# Altium schematic sheet motorvezerlo.SchDoc: Motorvezérlő
size A4
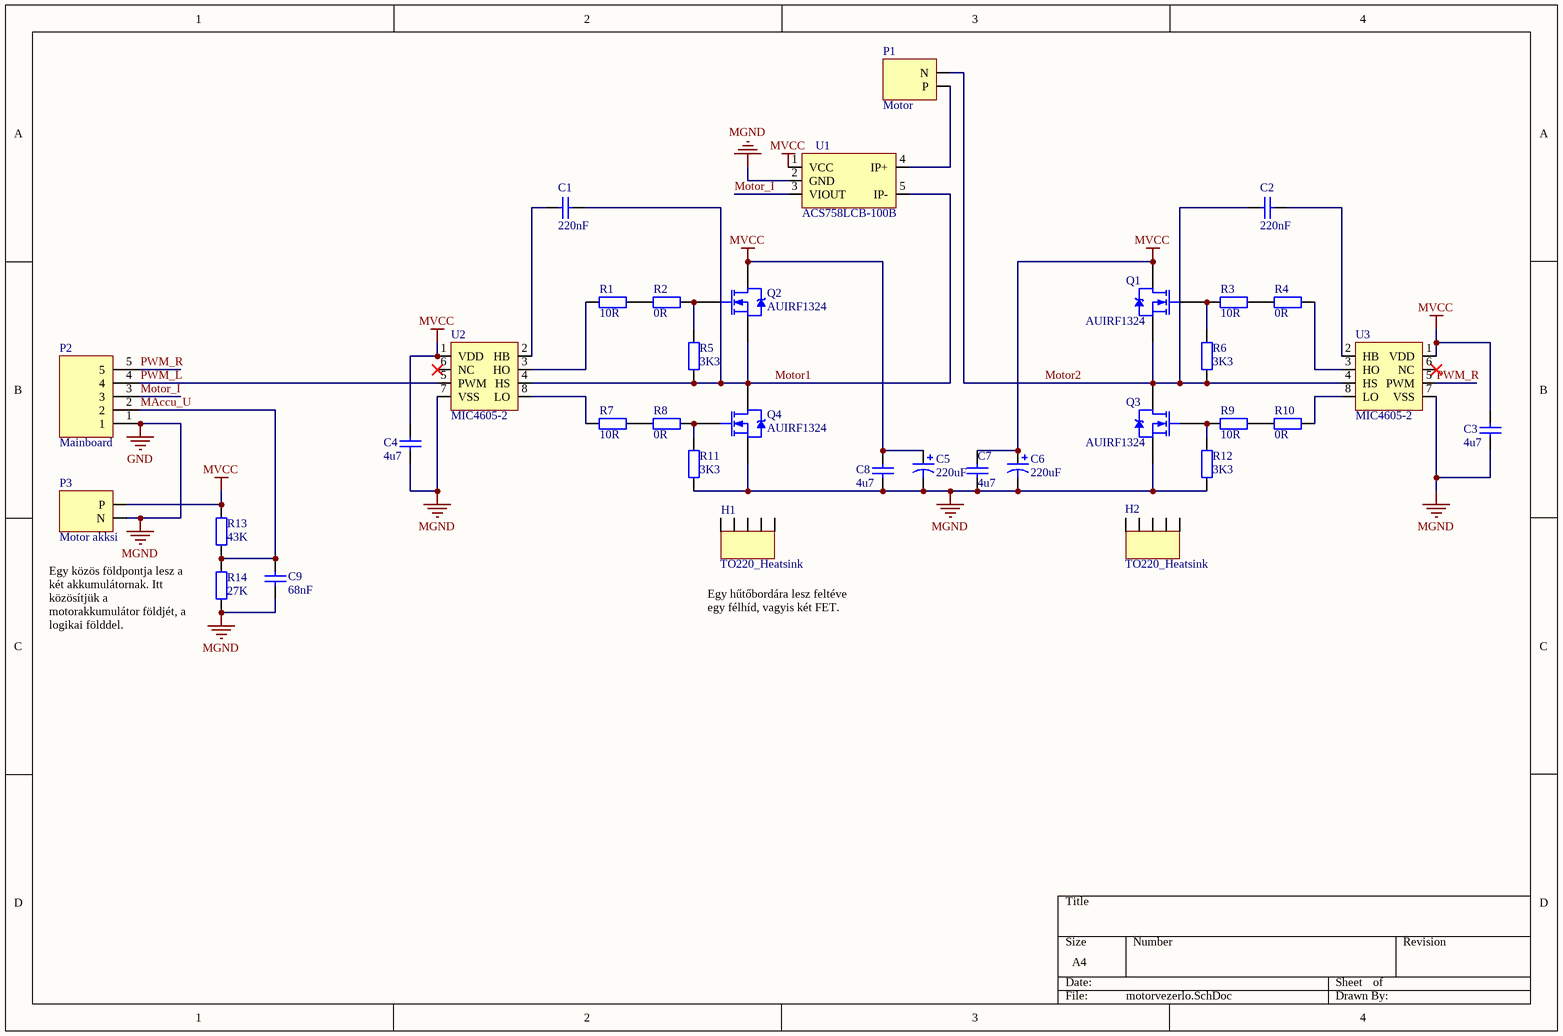
[diagram p0: motorvezerlo.SchDoc]

## Parts
C1  220nF  [FP_1206_CAP_125]
C2  220nF  [FP_1206_CAP_125]
C3  4u7  [FP_1206_CAP_125]
C4  4u7  [FP_1206_CAP_125]
C5  220uF  [THT_ELKO_10x16]
C6  220uF  [THT_ELKO_10x16]
C7  4u7  [FP_1206_CAP_125]
C8  4u7  [FP_1206_CAP_125]
C9  68nF  [FP_1206_CAP_125]
H1  TO220_Heatsink  [TO220_HEATSINK]
H2  TO220_Heatsink  [TO220_HEATSINK]
P1  Motor  [CONN_XT90]
P2  Mainboard  [FP_CONN5_TAP_254MM]
P3  Motor akksi  [CONN_XT90]
Q1  AUIRF1324  [TO-220AB]
Q2  AUIRF1324  [TO-220AB]
Q3  AUIRF1324  [TO-220AB]
Q4  AUIRF1324  [TO-220AB]
R1  10R  [FP_1206_RES]
R2  0R  [FP_1206_RES]
R3  10R  [FP_1206_RES]
R4  0R  [FP_1206_RES]
R5  3K3  [FP_1206_RES]
R6  3K3  [FP_1206_RES]
R7  10R  [FP_1206_RES]
R8  0R  [FP_1206_RES]
R9  10R  [FP_1206_RES]
R10  0R  [FP_1206_RES]
R11  3K3  [FP_1206_RES]
R12  3K3  [FP_1206_RES]
R13  43K  [FP_1206_RES]
R14  27K  [FP_1206_RES]
U1  ACS758LCB-100B  [ACS758LCB-5pin-PFF]
U2  MIC4605-2  [FP_SOIC8_N]
U3  MIC4605-2  [FP_SOIC8_N]

## Nets
GND: C3.1 C4.1 C5.N C6.N C7.1 C8.1 C9.1 P2.1 P3.N Q3.3(S) Q4.3(S) R11.1 R12.1 R14.1 U1.2(GND) U2.7(VSS) U3.7(VSS)  [also labelled MGND]
MVCC: C3.2 C4.2 C5.P C6.P C7.2 C8.2 P3.P Q1.2(D) Q2.2(D) R13.2 U1.1(VCC) U2.1(VDD) U3.1(VDD)
MAccu_U: C9.2 P2.2 R13.1 R14.2
Motor1: C1.1 Q2.3(S) Q4.2(D) R5.1 U1.5(IP-) U2.4(HS)
Motor2: C2.2 P1.N Q1.3(S) Q3.2(D) R6.1 U3.4(HS)
Motor_I: P2.3 U1.3(VIOUT)
PWM_L: P2.4 U2.5(PWM)
PWM_R: P2.5 U3.5(PWM)
NetC1_2: C1.2 U2.2(HB)
NetC2_1: C2.1 U3.2(HB)
NetP1_P: P1.P U1.4(IP+)
NetQ1_1: Q1.1(G) R3.1 R6.2
NetQ2_1: Q2.1(G) R2.2 R5.2
NetQ3_1: Q3.1(G) R9.1 R12.2
NetQ4_1: Q4.1(G) R8.2 R11.2
NetR1_1: R1.1 U2.3(HO)
NetR1_2: R1.2 R2.1
NetR3_2: R3.2 R4.1
NetR4_2: R4.2 U3.3(HO)
NetR7_1: R7.1 U2.8(LO)
NetR7_2: R7.2 R8.1
NetR9_2: R9.2 R10.1
NetR10_2: R10.2 U3.8(LO)

Not connected (* = marked no-connect by the designer): U2 6(NC)*; U3 6(NC)*

## Notes on the sheet
- Egy közös földpontja lesz a két akkumulátornak. Itt közösítjük a motorakkumulátor földjét, a logikai földdel.
- (near H1) Egy hűtőbordára lesz feltéve egy félhíd, vagyis két FET.

## Library data of the parts
C1 C2 = CAP: Capacitor; Name: 220nF 1206 10% 50V X7R CL31B224KBFNNNE (SAM); Supplier: Lomex; Reference: 82-09-87; Value: 220nF
C3 C4 C7 C8 = CAP: Capacitor; Name: 4.7uF 1206 10% 25V X7R CL31B475KAHNNNE (SAM); Supplier: Lomex; Reference: 82-06-22; Value: 4u7
C5 C6 = CAP_ELECT: Polarized Capacitor; Name: 220uF 50V 10x16 RM 5.0 20% 105° 10000h KTC227M050S1G6H16K (TEA) LOW ESR & IMP. HIGH RIPPLE, LONG LIFE; Supplier: Lomex; Reference: 12-21-33; Value: 220uF
C9 = CAP: Capacitor; Name: 68nF 1206 10% 50V X7R CC1206KRX7R9BB683 (YAG); Supplier: Lomex; Reference: 82-00-17; Value: 68nF
H1 H2 = TO220_Heatsink: TO220 Heatsink; Name: HŰTŐBORDA TO-220 35.6x 25.4x12.8mm ALUPROFIL ELOXÁLT; Reference: 22-00-40; Supplier: Lomex
P1 P3 = Connector_2pinPolarized: 2 pin polarized connector
P2 = Connector_5pin: 5pin Connector
Q1-Q4 = NMOS: NXP - BSP030,115 - MOSFET, N CH, 30V, 10A, SOT223; Reference: 1865599; Name: AUIRF1324 -  MOSFET Transistor, N Channel, 195 A, 24 V, 0.0012 ohm, 10 V, 2 V; Supplier: Farnell
R1 R3 R7 R9 = RES: Resistor; Name: 3R90 1206 1% WR12W3R90FTL 0.25W (WAL); Supplier: Lomex; Reference: 80-24-67; Value: 10R
R2 R4 R8 R10 = RES: Resistor; Name: 0R00 1206 CR-06JL7----0R 0.25W (VIK) Iav=2; Supplier: Lomex; Reference: 81-10-03; Value: 0R
R5 R6 R11 R12 = RES: Resistor; Name: 3K30 1206 1% WR12X3301FTL 0.25W (WAL); Supplier: Lomex; Reference: 80-20-37; Value: 3K3
R13 = RES: Resistor; Name: 43K0 1206 1% WR12X4302FTL 0.25W (WAL); Supplier: Lomex; Reference: 80-42-96; Value: 43K
R14 = RES: Resistor; Name: 27K0 1206 1% CR-06FL7---27K 0.25W (VIK); Supplier: Lomex; Reference: 80-10-43; Value: 27K
U1 = ACS758LCB-100B: ACS758LCB; Name: ACS758LCB-100B-PFF-T -  Current Sensor, Current Conductor, 10 mA, 120 kHz, PFF, 5 Pins, 3 V, 5.5 V; Reference: 1791393; Supplier: Farnell
U2 U3 = MIC4605-2: MOSFET driver half brifge; Name: MIC4605-2YM -  MOSFET Driver, Half Bridge, 5.5V-16V supply, SOIC-8; Reference: 2510169; Supplier: Farnell